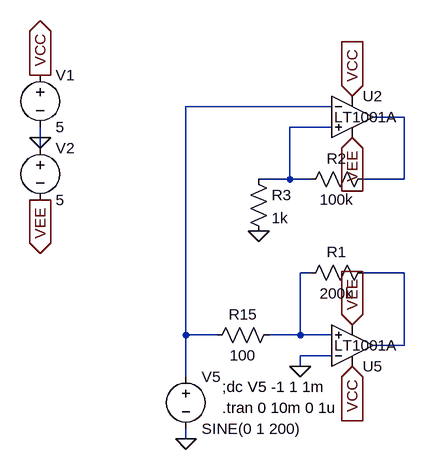
[diagram p0: schematic Comparador.asc]
Comparador.asc, the LTspice schematic file:
Version 4
SHEET 1 3400 680
WIRE 1232 -32 1008 -32
WIRE 1344 -16 1296 -16
WIRE 1232 0 1168 0
WIRE 784 16 784 0
WIRE 784 32 784 16
WIRE 1168 80 1168 0
WIRE 1168 80 1120 80
WIRE 1200 80 1168 80
WIRE 1344 80 1344 -16
WIRE 1344 80 1280 80
WIRE 1200 224 1184 224
WIRE 1344 224 1280 224
WIRE 1008 320 1008 -32
WIRE 1056 320 1008 320
WIRE 1184 320 1184 224
WIRE 1184 320 1136 320
WIRE 1232 320 1184 320
WIRE 1344 336 1344 224
WIRE 1344 336 1296 336
WIRE 1232 352 1184 352
WIRE 1184 368 1184 352
WIRE 1008 384 1008 320
WIRE 1008 480 1008 464
FLAG 784 16 0
FLAG 1008 480 0
FLAG 784 -80 VCC
IOPIN 784 -80 Out
FLAG 1264 368 VCC
IOPIN 1264 368 In
FLAG 784 112 VEE
IOPIN 784 112 Out
FLAG 1264 304 VEE
IOPIN 1264 304 In
FLAG 1184 368 0
FLAG 1264 -48 VCC
IOPIN 1264 -48 In
FLAG 1264 16 VEE
IOPIN 1264 16 In
FLAG 1120 160 0
SYMBOL voltage 784 -96 R0
WINDOW 123 0 0 Left 2
WINDOW 39 0 0 Left 2
SYMATTR InstName V1
SYMATTR Value 5
SYMBOL voltage 784 16 R0
WINDOW 123 0 0 Left 2
WINDOW 39 0 0 Left 2
SYMATTR InstName V2
SYMATTR Value 5
SYMBOL Opamps\\LT1001A 1264 400 M180
WINDOW 3 -28 64 Left 2
SYMATTR InstName U5
SYMBOL res 1040 336 R270
WINDOW 0 32 56 VTop 2
WINDOW 3 0 56 VBottom 2
SYMATTR InstName R15
SYMATTR Value 100
SYMBOL voltage 1008 368 R0
WINDOW 123 0 0 Left 2
WINDOW 39 0 0 Left 2
SYMATTR InstName V5
SYMATTR Value SINE(0 1 200)
SYMBOL res 1184 240 R270
WINDOW 0 32 56 VTop 2
WINDOW 3 0 56 VBottom 2
SYMATTR InstName R1
SYMATTR Value 200k
SYMBOL Opamps\\LT1001A 1264 -80 R0
WINDOW 3 -28 64 Left 2
SYMATTR InstName U2
SYMBOL res 1184 96 R270
WINDOW 0 32 56 VTop 2
WINDOW 3 0 56 VBottom 2
SYMATTR InstName R2
SYMATTR Value 100k
SYMBOL res 1104 64 R0
SYMATTR InstName R3
SYMATTR Value 1k
TEXT 1064 400 Left 2 !;dc V5 -1 1 1m
TEXT 1064 432 Left 2 !.tran 0 10m 0 1u

The netlist it stands for:
* Comparador.asc
V1 VCC 0 5
V2 0 VEE 5
XU5 N004 0 VCC VEE N005 LT1001  ; LT1001A, pins In+ In- V+ V- OUT
R15 N001 N004 100
V5 N001 0 SINE(0 1 200)
R1 N004 N005 200k
XU2 N003 N001 VCC VEE N002 LT1001  ; LT1001A, pins In+ In- V+ V- OUT
R2 N003 N002 100k
R3 N003 0 1k
;dc V5 -1 1 1m
.tran 0 10m 0 1u
.lib LTC.lib
.backanno
.end